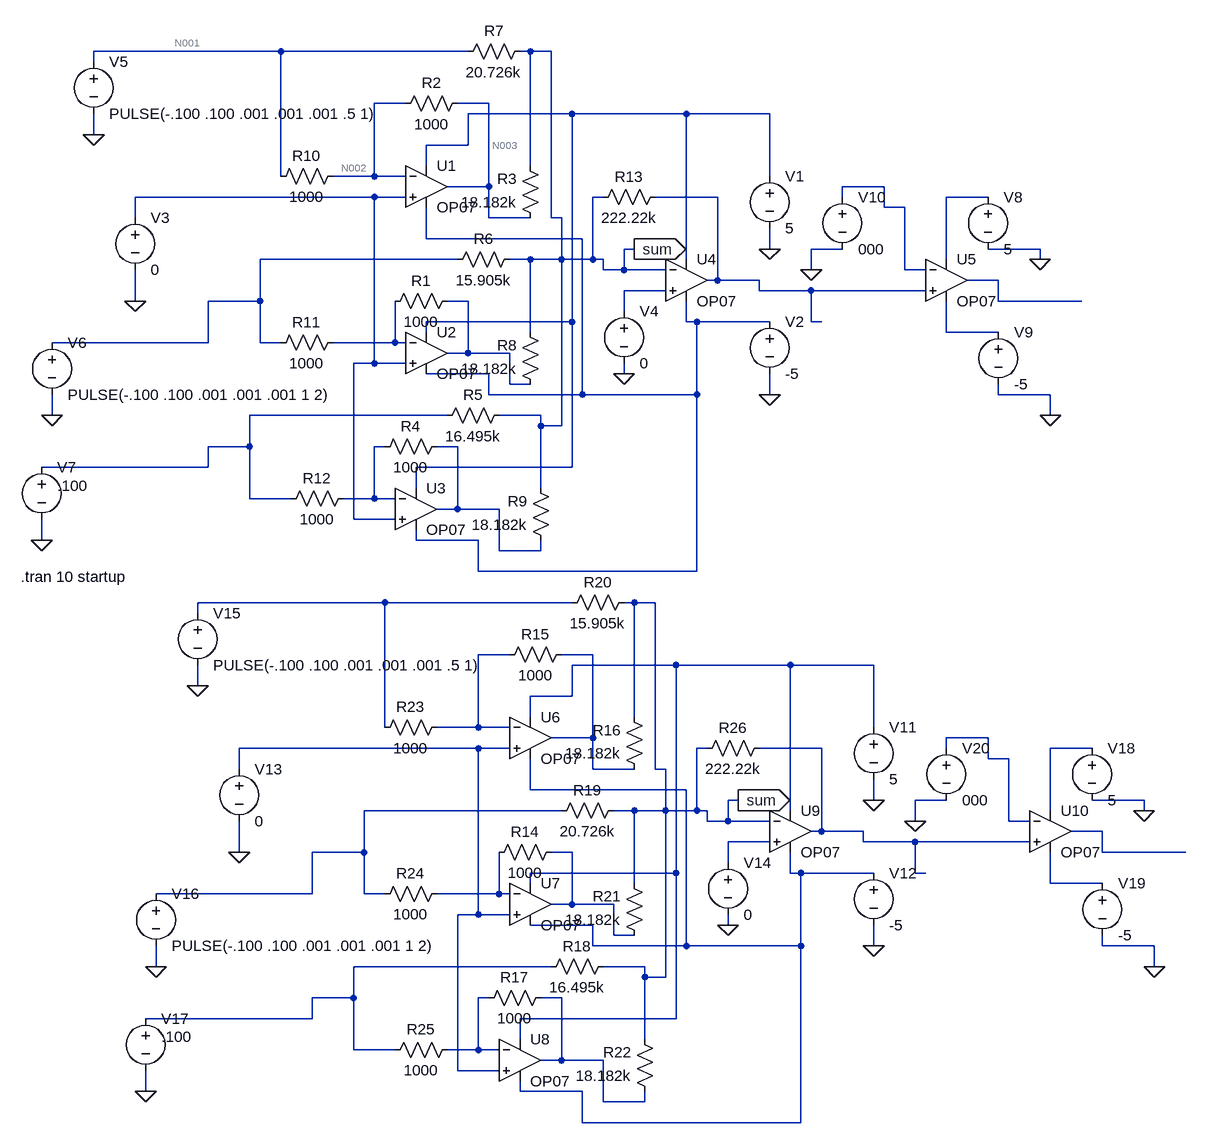
[diagram p0: schematic madaline_with_resistor.asc]
madaline_with_resistor.asc, the LTspice schematic file:
Version 4
SHEET 1 880 888
WIRE -1008 -784 -1296 -784
WIRE -720 -784 -1008 -784
WIRE -624 -784 -640 -784
WIRE -592 -784 -624 -784
WIRE -1296 -768 -1296 -784
WIRE -816 -704 -864 -704
WIRE -688 -704 -736 -704
WIRE -560 -688 -720 -688
WIRE -384 -688 -560 -688
WIRE -256 -688 -384 -688
WIRE -1296 -656 -1296 -688
WIRE -720 -640 -720 -688
WIRE -720 -640 -784 -640
WIRE -784 -608 -784 -640
WIRE -624 -608 -624 -784
WIRE -1008 -592 -1008 -784
WIRE -864 -592 -864 -704
WIRE -864 -592 -928 -592
WIRE -816 -592 -864 -592
WIRE -256 -592 -256 -688
WIRE -688 -576 -688 -704
WIRE -688 -576 -752 -576
WIRE -80 -576 -144 -576
WIRE -864 -560 -1232 -560
WIRE -816 -560 -864 -560
WIRE -512 -560 -528 -560
WIRE -336 -560 -432 -560
WIRE -144 -560 -144 -576
WIRE 80 -560 16 -560
WIRE -80 -544 -80 -576
WIRE -48 -544 -80 -544
WIRE -1232 -528 -1232 -560
WIRE -688 -528 -688 -576
WIRE -624 -528 -688 -528
WIRE -592 -528 -592 -784
WIRE -576 -528 -592 -528
WIRE -784 -496 -784 -544
WIRE -544 -496 -784 -496
WIRE -464 -480 -480 -480
WIRE -256 -480 -256 -512
WIRE -144 -480 -192 -480
WIRE 160 -480 80 -480
WIRE -736 -464 -1040 -464
WIRE -624 -464 -656 -464
WIRE -576 -464 -576 -528
WIRE -576 -464 -624 -464
WIRE -528 -464 -528 -560
WIRE -528 -464 -576 -464
WIRE -512 -464 -528 -464
WIRE -384 -464 -384 -688
WIRE 16 -464 16 -560
WIRE 160 -464 160 -480
WIRE -512 -448 -512 -464
WIRE -480 -448 -480 -480
WIRE -480 -448 -512 -448
WIRE -416 -448 -480 -448
WIRE -192 -448 -192 -480
WIRE -48 -448 -48 -544
WIRE -16 -448 -48 -448
WIRE -336 -432 -336 -560
WIRE -336 -432 -352 -432
WIRE -272 -432 -336 -432
WIRE 96 -432 48 -432
WIRE -416 -416 -480 -416
WIRE -272 -416 -272 -432
WIRE -192 -416 -272 -416
WIRE -16 -416 -192 -416
WIRE -1232 -400 -1232 -448
WIRE -1040 -400 -1040 -464
WIRE -1040 -400 -1120 -400
WIRE -720 -400 -752 -400
WIRE 96 -400 96 -432
WIRE 224 -400 96 -400
WIRE -480 -384 -480 -416
WIRE -560 -368 -560 -688
WIRE -560 -368 -784 -368
WIRE -384 -368 -384 -400
WIRE -368 -368 -384 -368
WIRE -256 -368 -368 -368
WIRE -192 -368 -192 -416
WIRE -176 -368 -192 -368
WIRE -784 -352 -784 -368
WIRE -624 -352 -624 -464
WIRE 16 -352 16 -400
WIRE 96 -352 16 -352
WIRE -1120 -336 -1120 -400
WIRE -1120 -336 -1360 -336
WIRE -1040 -336 -1040 -400
WIRE -1008 -336 -1040 -336
WIRE -832 -336 -832 -400
WIRE -832 -336 -928 -336
WIRE -816 -336 -832 -336
WIRE -720 -320 -720 -400
WIRE -720 -320 -752 -320
WIRE -656 -320 -720 -320
WIRE -864 -304 -864 -560
WIRE -864 -304 -896 -304
WIRE -816 -304 -864 -304
WIRE -688 -288 -784 -288
WIRE -480 -288 -480 -304
WIRE -656 -272 -656 -320
WIRE -624 -272 -656 -272
WIRE -688 -256 -688 -288
WIRE -544 -256 -544 -496
WIRE -544 -256 -688 -256
WIRE -368 -256 -368 -368
WIRE -368 -256 -544 -256
WIRE -256 -256 -256 -288
WIRE 96 -256 96 -272
WIRE 176 -256 96 -256
WIRE -1360 -224 -1360 -256
WIRE -752 -224 -1056 -224
WIRE -608 -224 -672 -224
WIRE 176 -224 176 -256
WIRE -608 -208 -608 -224
WIRE -576 -208 -576 -464
WIRE -576 -208 -608 -208
WIRE -1056 -176 -1056 -224
WIRE -1056 -176 -1120 -176
WIRE -848 -176 -864 -176
WIRE -736 -176 -768 -176
WIRE -1120 -144 -1120 -176
WIRE -1120 -144 -1376 -144
WIRE -560 -144 -560 -368
WIRE -560 -144 -800 -144
WIRE -800 -112 -800 -144
WIRE -608 -112 -608 -208
WIRE -1056 -96 -1056 -176
WIRE -992 -96 -1056 -96
WIRE -864 -96 -864 -176
WIRE -864 -96 -912 -96
WIRE -832 -96 -864 -96
WIRE -736 -80 -736 -176
WIRE -736 -80 -768 -80
WIRE -672 -80 -736 -80
WIRE -896 -64 -896 -304
WIRE -832 -64 -896 -64
WIRE -1376 -32 -1376 -64
WIRE -800 -32 -800 -48
WIRE -704 -32 -800 -32
WIRE -672 -16 -672 -80
WIRE -608 -16 -608 -32
WIRE -608 -16 -672 -16
WIRE -704 16 -704 -32
WIRE -368 16 -368 -256
WIRE -368 16 -704 16
WIRE -848 64 -1136 64
WIRE -560 64 -848 64
WIRE -464 64 -480 64
WIRE -432 64 -464 64
WIRE -1136 80 -1136 64
WIRE -656 144 -704 144
WIRE -528 144 -576 144
WIRE -400 160 -560 160
WIRE -224 160 -400 160
WIRE -96 160 -224 160
WIRE -1136 192 -1136 160
WIRE -560 208 -560 160
WIRE -560 208 -624 208
WIRE -624 240 -624 208
WIRE -464 240 -464 64
WIRE -848 256 -848 64
WIRE -704 256 -704 144
WIRE -704 256 -768 256
WIRE -656 256 -704 256
WIRE -96 256 -96 160
WIRE -528 272 -528 144
WIRE -528 272 -592 272
WIRE 80 272 16 272
WIRE -704 288 -1072 288
WIRE -656 288 -704 288
WIRE -352 288 -368 288
WIRE -176 288 -272 288
WIRE 16 288 16 272
WIRE 240 288 176 288
WIRE 80 304 80 272
WIRE 112 304 80 304
WIRE -1072 320 -1072 288
WIRE -528 320 -528 272
WIRE -464 320 -528 320
WIRE -432 320 -432 64
WIRE -416 320 -432 320
WIRE -624 352 -624 304
WIRE -384 352 -624 352
WIRE -304 368 -320 368
WIRE -96 368 -96 336
WIRE 16 368 -32 368
WIRE 320 368 240 368
WIRE -576 384 -880 384
WIRE -464 384 -496 384
WIRE -416 384 -416 320
WIRE -416 384 -464 384
WIRE -368 384 -368 288
WIRE -368 384 -416 384
WIRE -352 384 -368 384
WIRE -224 384 -224 160
WIRE 176 384 176 288
WIRE 320 384 320 368
WIRE -352 400 -352 384
WIRE -320 400 -320 368
WIRE -320 400 -352 400
WIRE -256 400 -320 400
WIRE -32 400 -32 368
WIRE 112 400 112 304
WIRE 144 400 112 400
WIRE -176 416 -176 288
WIRE -176 416 -192 416
WIRE -112 416 -176 416
WIRE 256 416 208 416
WIRE -256 432 -320 432
WIRE -112 432 -112 416
WIRE -32 432 -112 432
WIRE 144 432 -32 432
WIRE -1072 448 -1072 400
WIRE -880 448 -880 384
WIRE -880 448 -960 448
WIRE -560 448 -592 448
WIRE 256 448 256 416
WIRE 384 448 256 448
WIRE -320 464 -320 432
WIRE -400 480 -400 160
WIRE -400 480 -624 480
WIRE -224 480 -224 448
WIRE -208 480 -224 480
WIRE -96 480 -208 480
WIRE -32 480 -32 432
WIRE -16 480 -32 480
WIRE -624 496 -624 480
WIRE -464 496 -464 384
WIRE 176 496 176 448
WIRE 256 496 176 496
WIRE -960 512 -960 448
WIRE -960 512 -1200 512
WIRE -880 512 -880 448
WIRE -848 512 -880 512
WIRE -672 512 -672 448
WIRE -672 512 -768 512
WIRE -656 512 -672 512
WIRE -560 528 -560 448
WIRE -560 528 -592 528
WIRE -496 528 -560 528
WIRE -704 544 -704 288
WIRE -704 544 -736 544
WIRE -656 544 -704 544
WIRE -528 560 -624 560
WIRE -320 560 -320 544
WIRE -496 576 -496 528
WIRE -464 576 -496 576
WIRE -528 592 -528 560
WIRE -384 592 -384 352
WIRE -384 592 -528 592
WIRE -208 592 -208 480
WIRE -208 592 -384 592
WIRE -96 592 -96 560
WIRE 256 592 256 576
WIRE 336 592 256 592
WIRE -1200 624 -1200 592
WIRE -592 624 -896 624
WIRE -448 624 -512 624
WIRE 336 624 336 592
WIRE -448 640 -448 624
WIRE -416 640 -416 384
WIRE -416 640 -448 640
WIRE -896 672 -896 624
WIRE -896 672 -960 672
WIRE -688 672 -704 672
WIRE -576 672 -608 672
WIRE -960 704 -960 672
WIRE -960 704 -1216 704
WIRE -400 704 -400 480
WIRE -400 704 -640 704
WIRE -640 736 -640 704
WIRE -448 736 -448 640
WIRE -896 752 -896 672
WIRE -832 752 -896 752
WIRE -704 752 -704 672
WIRE -704 752 -752 752
WIRE -672 752 -704 752
WIRE -576 768 -576 672
WIRE -576 768 -608 768
WIRE -512 768 -576 768
WIRE -736 784 -736 544
WIRE -672 784 -736 784
WIRE -1216 816 -1216 784
WIRE -640 816 -640 800
WIRE -544 816 -640 816
WIRE -512 832 -512 768
WIRE -448 832 -448 816
WIRE -448 832 -512 832
WIRE -544 864 -544 816
WIRE -208 864 -208 592
WIRE -208 864 -544 864
FLAG -256 -480 0
FLAG -256 -256 0
FLAG -1232 -400 0
FLAG -480 -288 0
FLAG -1296 -656 0
FLAG -1360 -224 0
FLAG -1376 -32 0
FLAG 160 -464 0
FLAG 176 -224 0
FLAG -192 -448 0
FLAG -464 -480 sum
IOPIN -464 -480 Out
FLAG -96 368 0
FLAG -96 592 0
FLAG -1072 448 0
FLAG -320 560 0
FLAG -1136 192 0
FLAG -1200 624 0
FLAG -1216 816 0
FLAG 320 384 0
FLAG 336 624 0
FLAG -32 400 0
FLAG -304 368 sum
IOPIN -304 368 Out
SYMBOL Opamps\\OP07 -784 -640 R0
SYMATTR InstName U1
SYMBOL Opamps\\OP07 -784 -384 R0
SYMATTR InstName U2
SYMBOL Opamps\\OP07 -800 -144 R0
SYMATTR InstName U3
SYMBOL Opamps\\OP07 -384 -496 R0
SYMATTR InstName U4
SYMBOL voltage -256 -608 R0
WINDOW 123 0 0 Left 2
WINDOW 39 0 0 Left 2
SYMATTR InstName V1
SYMATTR Value 5
SYMBOL voltage -256 -384 R0
WINDOW 123 0 0 Left 2
WINDOW 39 0 0 Left 2
SYMATTR InstName V2
SYMATTR Value -5
SYMBOL res -736 -416 R90
WINDOW 0 0 56 VBottom 2
WINDOW 3 32 56 VTop 2
SYMATTR InstName R1
SYMATTR Value 1000
SYMBOL res -720 -720 R90
WINDOW 0 0 56 VBottom 2
WINDOW 3 32 56 VTop 2
SYMATTR InstName R2
SYMATTR Value 1000
SYMBOL res -608 -512 R180
WINDOW 0 36 76 Left 2
WINDOW 3 36 40 Left 2
SYMATTR InstName R3
SYMATTR Value 18.182k
SYMBOL res -752 -192 R90
WINDOW 0 0 56 VBottom 2
WINDOW 3 32 56 VTop 2
SYMATTR InstName R4
SYMATTR Value 1000
SYMBOL res -656 -240 R90
WINDOW 0 0 56 VBottom 2
WINDOW 3 32 56 VTop 2
SYMATTR InstName R5
SYMATTR Value 16.495k
SYMBOL res -640 -480 R90
WINDOW 0 0 56 VBottom 2
WINDOW 3 32 56 VTop 2
SYMATTR InstName R6
SYMATTR Value 15.905k
SYMBOL res -624 -800 R90
WINDOW 0 0 56 VBottom 2
WINDOW 3 32 56 VTop 2
SYMATTR InstName R7
SYMATTR Value 20.726k
SYMBOL res -608 -256 R180
WINDOW 0 36 76 Left 2
WINDOW 3 36 40 Left 2
SYMATTR InstName R8
SYMATTR Value 18.182k
SYMBOL res -592 -16 R180
WINDOW 0 36 76 Left 2
WINDOW 3 36 40 Left 2
SYMATTR InstName R9
SYMATTR Value 18.182k
SYMBOL res -912 -608 R90
WINDOW 0 0 56 VBottom 2
WINDOW 3 32 56 VTop 2
SYMATTR InstName R10
SYMATTR Value 1000
SYMBOL res -912 -352 R90
WINDOW 0 0 56 VBottom 2
WINDOW 3 32 56 VTop 2
SYMATTR InstName R11
SYMATTR Value 1000
SYMBOL res -896 -112 R90
WINDOW 0 0 56 VBottom 2
WINDOW 3 32 56 VTop 2
SYMATTR InstName R12
SYMATTR Value 1000
SYMBOL res -416 -576 R90
WINDOW 0 0 56 VBottom 2
WINDOW 3 32 56 VTop 2
SYMATTR InstName R13
SYMATTR Value 222.22k
SYMBOL voltage -1232 -544 R0
WINDOW 123 0 0 Left 2
WINDOW 39 0 0 Left 2
SYMATTR InstName V3
SYMATTR Value 0
SYMBOL voltage -480 -400 R0
WINDOW 123 0 0 Left 2
WINDOW 39 0 0 Left 2
SYMATTR InstName V4
SYMATTR Value 0
SYMBOL voltage -1296 -784 R0
WINDOW 123 0 0 Left 2
WINDOW 39 0 0 Left 2
SYMATTR InstName V5
SYMATTR Value PULSE(-.100 .100 .001 .001 .001 .5 1)
SYMBOL voltage -1360 -352 R0
WINDOW 123 0 0 Left 2
WINDOW 39 0 0 Left 2
SYMATTR InstName V6
SYMATTR Value PULSE(-.100 .100 .001 .001 .001 1 2)
SYMBOL voltage -1376 -160 R0
WINDOW 3 24 44 Left 2
WINDOW 123 0 0 Left 2
WINDOW 39 0 0 Left 2
SYMATTR Value .100
SYMATTR InstName V7
SYMBOL Opamps\\OP07 16 -496 R0
SYMATTR InstName U5
SYMBOL voltage 80 -576 R0
WINDOW 123 0 0 Left 2
WINDOW 39 0 0 Left 2
SYMATTR InstName V8
SYMATTR Value 5
SYMBOL voltage 96 -368 R0
WINDOW 123 0 0 Left 2
WINDOW 39 0 0 Left 2
SYMATTR InstName V9
SYMATTR Value -5
SYMBOL voltage -144 -576 R0
WINDOW 123 0 0 Left 2
WINDOW 39 0 0 Left 2
SYMATTR InstName V10
SYMATTR Value 000
SYMBOL Opamps\\OP07 -624 208 R0
SYMATTR InstName U6
SYMBOL Opamps\\OP07 -624 464 R0
SYMATTR InstName U7
SYMBOL Opamps\\OP07 -640 704 R0
SYMATTR InstName U8
SYMBOL Opamps\\OP07 -224 352 R0
SYMATTR InstName U9
SYMBOL voltage -96 240 R0
WINDOW 123 0 0 Left 2
WINDOW 39 0 0 Left 2
SYMATTR InstName V11
SYMATTR Value 5
SYMBOL voltage -96 464 R0
WINDOW 123 0 0 Left 2
WINDOW 39 0 0 Left 2
SYMATTR InstName V12
SYMATTR Value -5
SYMBOL res -576 432 R90
WINDOW 0 0 56 VBottom 2
WINDOW 3 32 56 VTop 2
SYMATTR InstName R14
SYMATTR Value 1000
SYMBOL res -560 128 R90
WINDOW 0 0 56 VBottom 2
WINDOW 3 32 56 VTop 2
SYMATTR InstName R15
SYMATTR Value 1000
SYMBOL res -448 336 R180
WINDOW 0 36 76 Left 2
WINDOW 3 36 40 Left 2
SYMATTR InstName R16
SYMATTR Value 18.182k
SYMBOL res -592 656 R90
WINDOW 0 0 56 VBottom 2
WINDOW 3 32 56 VTop 2
SYMATTR InstName R17
SYMATTR Value 1000
SYMBOL res -496 608 R90
WINDOW 0 0 56 VBottom 2
WINDOW 3 32 56 VTop 2
SYMATTR InstName R18
SYMATTR Value 16.495k
SYMBOL res -480 368 R90
WINDOW 0 0 56 VBottom 2
WINDOW 3 32 56 VTop 2
SYMATTR InstName R19
SYMATTR Value 20.726k
SYMBOL res -464 48 R90
WINDOW 0 0 56 VBottom 2
WINDOW 3 32 56 VTop 2
SYMATTR InstName R20
SYMATTR Value 15.905k
SYMBOL res -448 592 R180
WINDOW 0 36 76 Left 2
WINDOW 3 36 40 Left 2
SYMATTR InstName R21
SYMATTR Value 18.182k
SYMBOL res -432 832 R180
WINDOW 0 36 76 Left 2
WINDOW 3 36 40 Left 2
SYMATTR InstName R22
SYMATTR Value 18.182k
SYMBOL res -752 240 R90
WINDOW 0 0 56 VBottom 2
WINDOW 3 32 56 VTop 2
SYMATTR InstName R23
SYMATTR Value 1000
SYMBOL res -752 496 R90
WINDOW 0 0 56 VBottom 2
WINDOW 3 32 56 VTop 2
SYMATTR InstName R24
SYMATTR Value 1000
SYMBOL res -736 736 R90
WINDOW 0 0 56 VBottom 2
WINDOW 3 32 56 VTop 2
SYMATTR InstName R25
SYMATTR Value 1000
SYMBOL res -256 272 R90
WINDOW 0 0 56 VBottom 2
WINDOW 3 32 56 VTop 2
SYMATTR InstName R26
SYMATTR Value 222.22k
SYMBOL voltage -1072 304 R0
WINDOW 123 0 0 Left 2
WINDOW 39 0 0 Left 2
SYMATTR InstName V13
SYMATTR Value 0
SYMBOL voltage -320 448 R0
WINDOW 123 0 0 Left 2
WINDOW 39 0 0 Left 2
SYMATTR InstName V14
SYMATTR Value 0
SYMBOL voltage -1136 64 R0
WINDOW 123 0 0 Left 2
WINDOW 39 0 0 Left 2
SYMATTR InstName V15
SYMATTR Value PULSE(-.100 .100 .001 .001 .001 .5 1)
SYMBOL voltage -1200 496 R0
WINDOW 123 0 0 Left 2
WINDOW 39 0 0 Left 2
SYMATTR InstName V16
SYMATTR Value PULSE(-.100 .100 .001 .001 .001 1 2)
SYMBOL voltage -1216 688 R0
WINDOW 3 24 44 Left 2
WINDOW 123 0 0 Left 2
WINDOW 39 0 0 Left 2
SYMATTR Value .100
SYMATTR InstName V17
SYMBOL Opamps\\OP07 176 352 R0
SYMATTR InstName U10
SYMBOL voltage 240 272 R0
WINDOW 123 0 0 Left 2
WINDOW 39 0 0 Left 2
SYMATTR InstName V18
SYMATTR Value 5
SYMBOL voltage 256 480 R0
WINDOW 123 0 0 Left 2
WINDOW 39 0 0 Left 2
SYMATTR InstName V19
SYMATTR Value -5
SYMBOL voltage 16 272 R0
WINDOW 123 0 0 Left 2
WINDOW 39 0 0 Left 2
SYMATTR InstName V20
SYMATTR Value 000
TEXT -1408 24 Left 2 !.tran 10 startup

The netlist it stands for:
* madaline_with_resistor.asc
XU1 N006 N002 N004 N009 N003 LT1001  ; OP07, pins In+ In- V+ V- OUT
XU2 N006 N015 N004 N009 N013 LT1001  ; OP07, pins In+ In- V+ V- OUT
XU3 N006 N017 N004 N009 N018 LT1001  ; OP07, pins In+ In- V+ V- OUT
XU4 N012 sum N004 N009 N007 LT1001  ; OP07, pins In+ In- V+ V- OUT
V1 N004 0 5
V2 N009 0 -5
R1 N013 N015 1000
R2 N003 N002 1000
R3 N003 sum 18.182k
R4 N018 N017 1000
R5 sum N016 16.495k
R6 sum N010 15.905k
R7 sum N001 20.726k
R8 N013 sum 18.182k
R9 N018 sum 18.182k
R10 N002 N001 1000
R11 N015 N010 1000
R12 N017 N016 1000
R13 N007 sum 222.22k
V3 N006 0 0
V4 N012 0 0
V5 N001 0 PULSE(-.100 .100 .001 .001 .001 .5 1)
V6 N010 0 PULSE(-.100 .100 .001 .001 .001 1 2)
V7 N016 0 .100
XU5 N007 N005 N008 N014 N011 LT1001  ; OP07, pins In+ In- V+ V- OUT
V8 N008 0 5
V9 N014 0 -5
V10 N005 0 000
XU6 N024 N020 N022 N027 N021 LT1001  ; OP07, pins In+ In- V+ V- OUT
XU7 N024 N033 N022 N027 N031 LT1001  ; OP07, pins In+ In- V+ V- OUT
XU8 N024 N035 N022 N027 N036 LT1001  ; OP07, pins In+ In- V+ V- OUT
XU9 N030 sum N022 N027 N025 LT1001  ; OP07, pins In+ In- V+ V- OUT
V11 N022 0 5
V12 N027 0 -5
R14 N031 N033 1000
R15 N021 N020 1000
R16 N021 sum 18.182k
R17 N036 N035 1000
R18 sum N034 16.495k
R19 sum N028 20.726k
R20 sum N019 15.905k
R21 N031 sum 18.182k
R22 N036 sum 18.182k
R23 N020 N019 1000
R24 N033 N028 1000
R25 N035 N034 1000
R26 N025 sum 222.22k
V13 N024 0 0
V14 N030 0 0
V15 N019 0 PULSE(-.100 .100 .001 .001 .001 .5 1)
V16 N028 0 PULSE(-.100 .100 .001 .001 .001 1 2)
V17 N034 0 .100
XU10 N025 N023 N026 N032 N029 LT1001  ; OP07, pins In+ In- V+ V- OUT
V18 N026 0 5
V19 N032 0 -5
V20 N023 0 000
.tran 10 startup
.lib LTC.lib
.backanno
.end

* Results of the author's LTspice run, read from the files saved beside the schematic
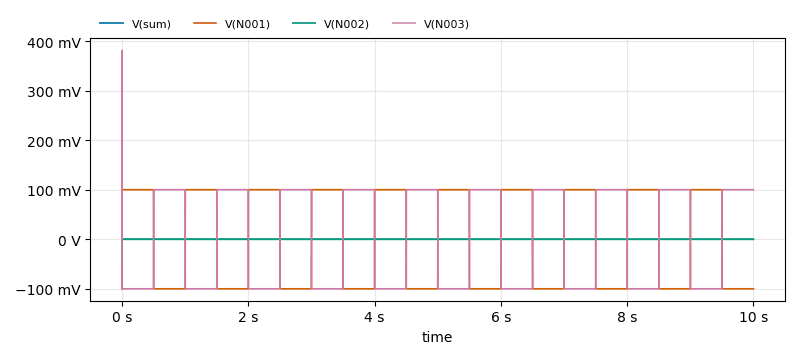
[diagram p1: Transient Analysis of madaline_with_resistor.asc, plotted from the saved traces]
* Transient Analysis, 1 run:
*   V(sum): min -32.84 mV, max 158.8 mV, average 253 nV, rms 89.41 µV, last 132.7 nV
*   V(N001): min -100 mV, max 100 mV, average 200 µV, rms 99.97 mV, last -100 mV
*   V(N002): min -50.42 mV, max 140.6 mV, average 48.37 nV, rms 77.12 µV, last -138.6 nV
*   V(N003): min -100 mV, max 381.2 mV, average -199.9 µV, rms 99.97 mV, last 100 mV